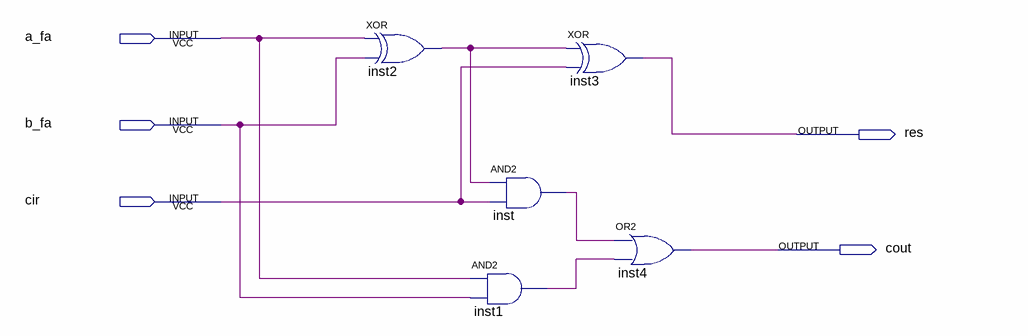
[diagram p0: schematic sheet]
// Quartus schematic 1-bit-adder.bdf as structural Verilog: 5 symbols, 5 pins
module \1-bit-adder  (
  input  a_fa,
  input  b_fa,
  input  cir,
  output res,
  output cout
);

  wire inst1_out, inst2_out, inst_out;

  xor inst2 (inst2_out, a_fa, b_fa);
  and inst (inst_out, inst2_out, cir);
  and inst1 (inst1_out, a_fa, b_fa);
  xor inst3 (res, inst2_out, cir);
  or inst4 (cout, inst_out, inst1_out);
endmodule
